# EAGLE design ardu_heli (EAGLE 5.10)
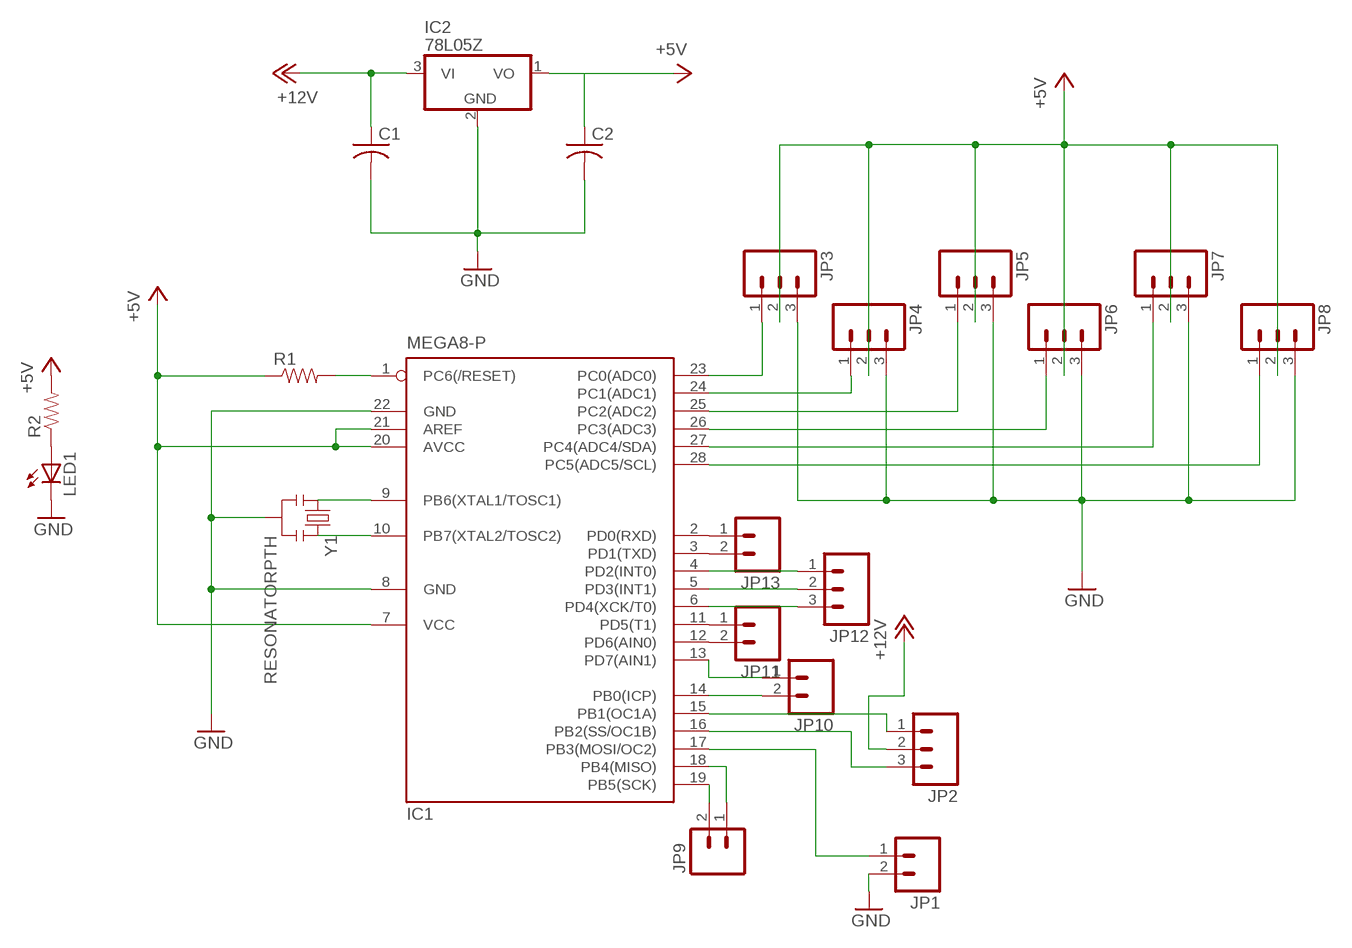
[diagram p0: schematic, sheet 1]

## Parts
C1  C-US025-030X050  [C025-030X050]
C2  C-US025-030X050  [C025-030X050]
IC1  MEGA8-P  [DIL28-3]
IC2  78L05Z  [TO92]
JP1  M02PTH  [1X02]
JP2  M03PTH  [1X03]
JP3  M03PTH  [1X03]
JP4  M03PTH  [1X03]
JP5  M03PTH  [1X03]
JP6  M03PTH  [1X03]
JP7  M03PTH  [1X03]
JP8  M03PTH  [1X03]
JP9  M02PTH  [1X02]
JP10  M02PTH  [1X02]
JP11  M02PTH  [1X02]
JP12  M03PTH  [1X03]
JP13  M02PTH  [1X02]
LED1  LED3MM  [LED3MM]
R1  RESISTORPTH-1/6W  [1/6W-RES]
R2  RESISTORPTH-1/6W  [1/6W-RES]
Y1  RESONATORPTH  [RESONATOR-PTH]

## Nets
+5V: C2.1 IC1.7(VCC) IC1.20(AVCC) IC1.21(AREF) IC2.1(VO) JP3.2 JP4.2 JP5.2 JP6.2 JP7.2 JP8.2 R1.1 R2.2
+12V: C1.1 IC2.3(VI) JP2.2
GND: C1.2 C2.2 IC1.8(GND) IC1.22(GND) IC2.2(GND) JP1.2 JP3.3 JP4.3 JP5.3 JP6.3 JP7.3 JP8.3 LED1.K(C) Y1.2
N$1: IC1.10(PB7(XTAL2/TOSC2)) Y1.3
N$2: IC1.9(PB6(XTAL1/TOSC1)) Y1.1
N$3: IC1.23(PC0(ADC0)) JP3.1
N$4: IC1.24(PC1(ADC1)) JP4.1
N$5: IC1.1(PC6(/RESET)) R1.2
N$6: IC1.15(PB1(OC1A)) JP2.1
N$7: IC1.16(PB2(SS/OC1B)) JP2.3
N$8: IC1.17(PB3(MOSI/OC2)) JP1.1
N$9: IC1.25(PC2(ADC2)) JP5.1
N$10: IC1.26(PC3(ADC3)) JP6.1
N$11: IC1.27(PC4(ADC4/SDA)) JP7.1
N$12: IC1.28(PC5(ADC5/SCL)) JP8.1
N$13: IC1.11(PD5(T1)) JP11.1
N$14: IC1.12(PD6(AIN0)) JP11.2
N$15: IC1.13(PD7(AIN1)) JP10.1
N$16: IC1.14(PB0(ICP)) JP10.2
N$17: IC1.19(PB5(SCK)) JP9.2
N$18: IC1.18(PB4(MISO)) JP9.1
N$19: IC1.2(PD0(RXD)) JP13.1
N$20: IC1.3(PD1(TXD)) JP13.2
N$21: IC1.6(PD4(XCK/T0)) JP12.3
N$22: IC1.5(PD3(INT1)) JP12.2
N$23: IC1.4(PD2(INT0)) JP12.1
N$24: LED1.A R2.1

## Library data of the parts
C1 C2 = rcl:C-US: CAPACITOR, American symbol
IC1 = atmel:MEGA8-P: MICROCONTROLLER 8 Kbytes FLASH, 1 kbytes SRAM, 512 bytes EEPROM, USART, 4-channel 10 bit ADC, 2-channel 8 bit ADC Pin compatible with Atmega48, ATMega88, ATMega168 Source: avr.lbr
IC2 = linear:78*: Positive VOLTAGE REGULATOR Source: http://cache.national.com/ds/LM/LM78L05.pdf http://www.fairchildsemi.com/ds/LM/LM7805.pdf
JP1 JP9-JP11 JP13 = SparkFun:M02: Header 2 Standard 2-pin 0.1" header. Use with straight break away headers (SKU : PRT-00116), right angle break away headers (PRT-00553), swiss pins (PRT-00743), machine pins (PRT-00117), and female headers (PRT-00115). Molex polarized connector foot print use with SKU : PRT-08233 with associated crimp pins and housings.
JP2-JP8 JP12 = SparkFun:M03: Header 3 Standard 3-pin 0.1" header. Use with straight break away headers (SKU : PRT-00116), right angle break away headers (PRT-00553), swiss pins (PRT-00743), machine pins (PRT-00117), and female headers (PRT-00115). Molex polarized connector foot print use with SKU : PRT-08232 with associated crimp pins and housings.
LED1 = SparkFun:LED: LEDs Standard schematic elements and footprints for 5mm, 3mm, 1206, and 0603 sized LEDs. 5mm - Spark Fun Electronics SKU : COM-00529 (and others)
R1 R2 = SparkFun:RESISTOR: Resistor Basic schematic elements and footprints for 0603, 1206, and PTH 1/10th watt (small) resistors.
Y1 = SparkFun:RESONATOR: Resonator Small SMD resonator. This is the itty bitty 10/20MHz resonators with built in caps. CSTCE10M0G55 and CSTCE20M0V53. Footprint has been reviewed closely but hasn't been tested yet.

## Board
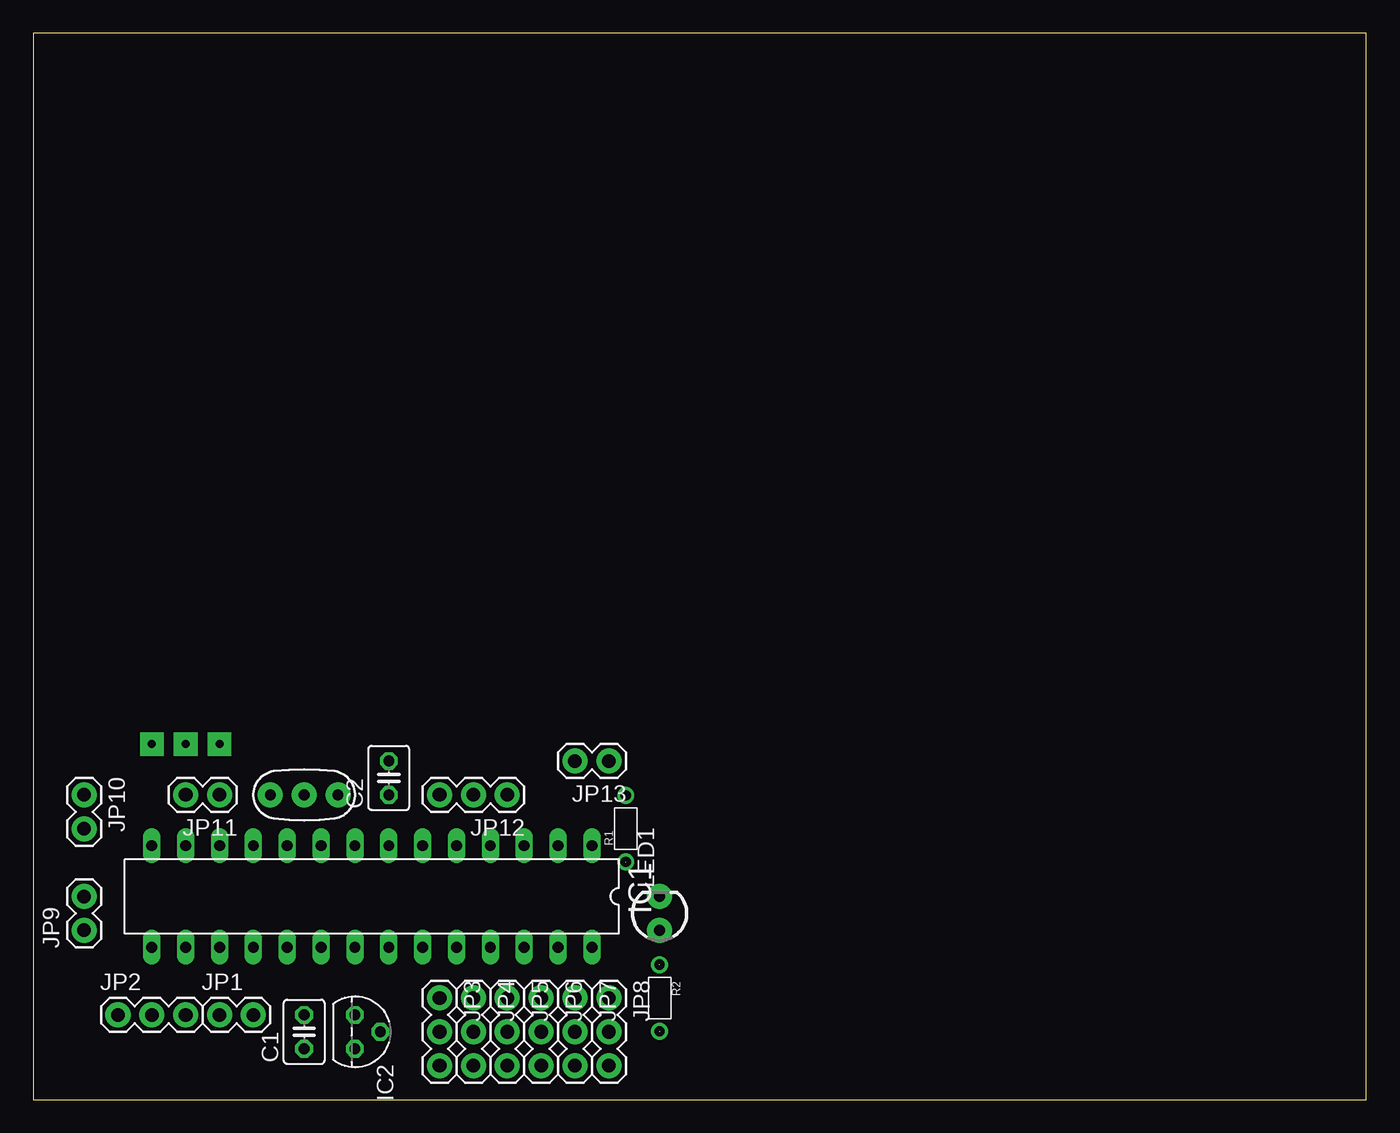
[diagram p1: board, top side]
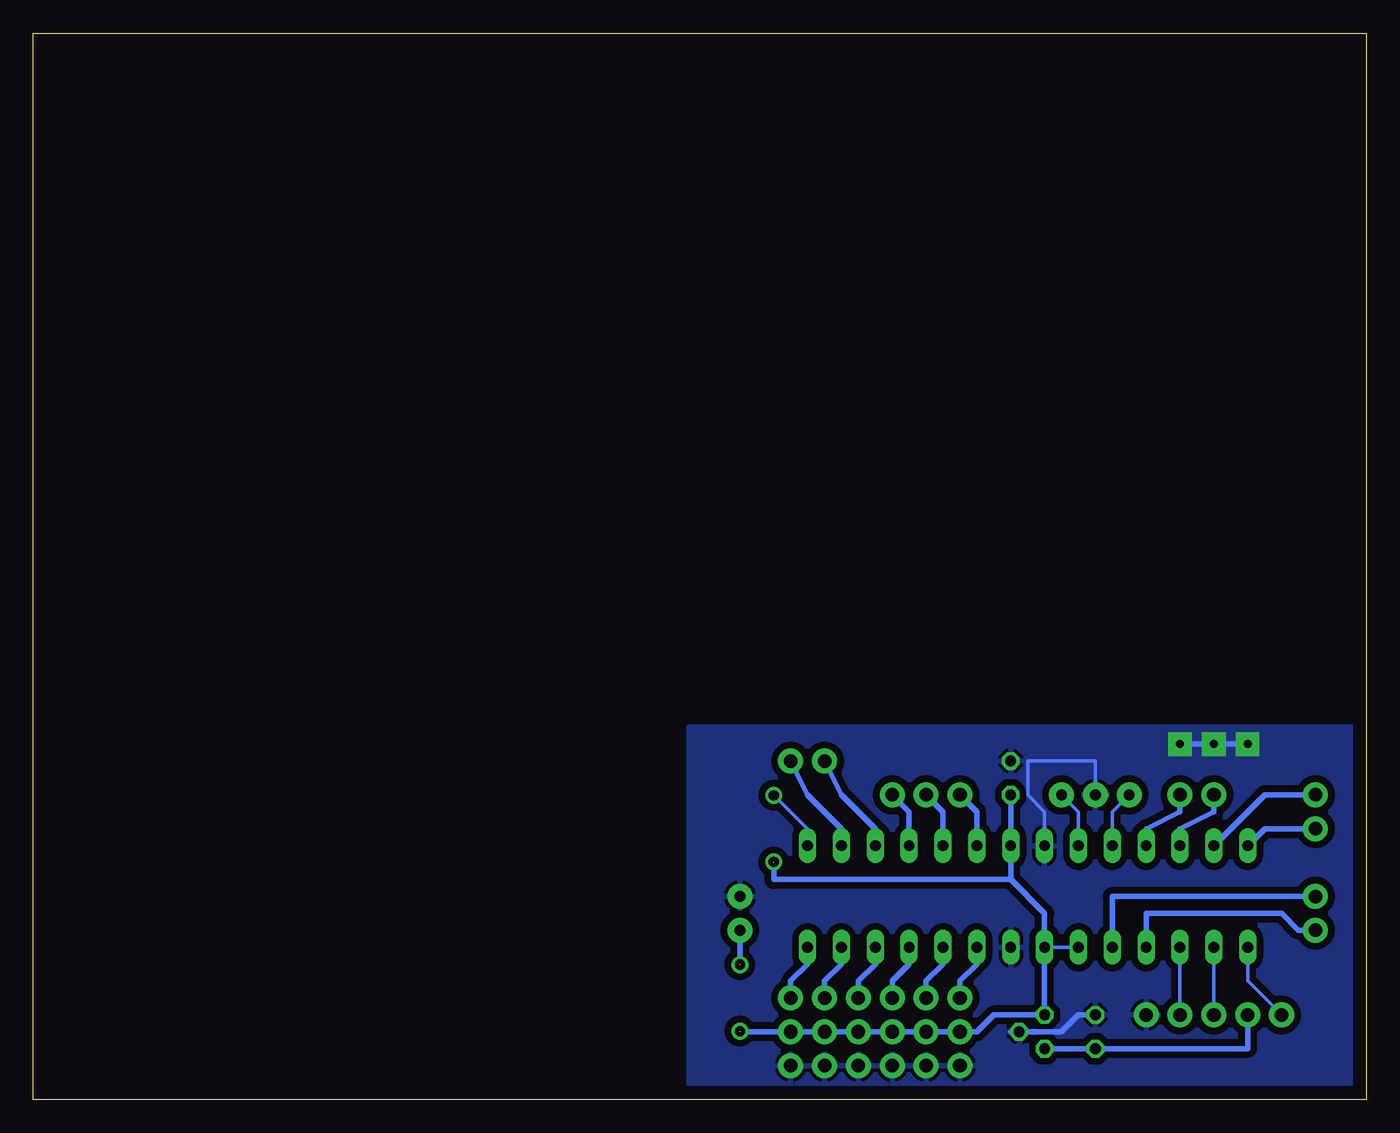
[diagram p2: board, bottom side, seen from below]

Size 100 x 80 mm. Coordinates in mm from the lower left corner, seen from the top.
Outline: 0,0 100,0 100,80 0,80 0,0
Copper layers (1*16): Top 0.035mm / dielectric 1.5mm / Bottom 0.035mm
Design rules "default *": minimum track width 10mil, minimum drill 24mil, track to track 20mil, track to pad 20mil, pad to pad 8mil, via to via 8mil, smd to smd 8mil, copper to edge 40mil, drill to drill 8mil, minimum pad ring 10mil, minimum via ring 8mil, stop-mask expansion 4mil, vias tented up to drill 0mil, thermal gap 10mil

### Footprints (pad centres in the part's own frame; a part is rotated, then mirrored left to right if it is on the bottom)
C025-030X050 = drill 0.813 octagon: 1 -1.27,0; 2 1.27,0
DIL28-3 = drill 0.813 long: 1 -16.51,-3.81; 2 -13.97,-3.81; 3 -11.43,-3.81; 4 -8.89,-3.81; 5 -6.35,-3.81; 6 -3.81,-3.81; 7 -1.27,-3.81; 8 1.27,-3.81; 9 3.81,-3.81; 10 6.35,-3.81; 11 8.89,-3.81; 12 11.43,-3.81; 13 13.97,-3.81; 14 16.51,-3.81; 15 16.51,3.81; 16 13.97,3.81; 17 11.43,3.81; 18 8.89,3.81; 19 6.35,3.81; 20 3.81,3.81; 21 1.27,3.81; 22 -1.27,3.81; 23 -3.81,3.81; 24 -6.35,3.81; 25 -8.89,3.81; 26 -11.43,3.81; 27 -13.97,3.81; 28 -16.51,3.81
TO92 = drill 0.813 octagon: 1 -1.27,0; 2 0,1.905; 3 1.27,0
1X02 = drill 1.016 pad 1.88 round: 1 0,0; 2 2.54,0
1X03 = drill 1.016 pad 1.88 round: 1 0,0; 2 2.54,0; 3 5.08,0
LED3MM = drill 0.813 pad 1.88 round: A -1.27,0; K 1.27,0
1/6W-RES = drill 0.762 round: 1 -2.5,0; 2 2.5,0
RESONATOR-PTH = drill 0.8 pad 1.88 round: 1 -2.54,0; 2 0,0; 3 2.54,0

### Placement (x,y rotation side)
C1  20.32,5.08 90 top
C2  26.67,24.13 90 top
IC1  25.4,15.24 180 top
IC2  24.13,5.08 270 top
JP1  13.97,6.35 0 top
JP2  6.35,6.35 0 top
JP3  30.48,7.62 270 top
JP4  33.02,7.62 270 top
JP5  35.56,7.62 270 top
JP6  38.1,7.62 270 top
JP7  40.64,7.62 270 top
JP8  43.18,7.62 270 top
JP9  3.81,12.7 90 top
JP10  3.81,22.86 270 top
JP11  13.97,22.86 180 top
JP12  35.56,22.86 180 top
JP13  43.18,25.4 180 top
LED1  46.99,13.97 90 top
R1  44.45,20.32 90 top
R2  46.99,7.62 270 top
Y1  20.32,22.86 180 top

### Tracks (layer width: path | path; a pad name or v marks a point on that pad's centre or on a via)
+5V  (2 unrouted)
  Bottom 0.254: IC1.21 IC1.20
  Bottom 0.406: 26.67,16.51 24.13,13.97 IC1.21 IC2.1 27.94,6.35 29.21,5.08 JP3.2 JP4.2 JP5.2 JP6.2 JP7.2 JP8.2 46.99,5.08 | 26.67,16.51 IC1.7 C2.1 | 26.67,16.51 44.45,16.51 44.45,17.78
+12V
  Bottom 0.406: IC2.3 C1.1 8.89,3.81 JP2.2
GND  (via drill 0.6 pad 1.78)
  Bottom 0.254: IC1.8 24.13,21.59 25.4,22.86 25.4,25.4 20.32,25.4 Y1.2
  Bottom 0.406: IC2.2 26.67,5.08 | v8.89,26.67 v11.43,26.67 v13.97,26.67 | 25.4,5.08 22.86,5.08 21.59,6.35 C1.2
  pour Bottom: 0,27.94 0,0 50.8,0 50.8,27.94
N$1
  Bottom 0.254: IC1.10 19.05,21.59 Y1.3
N$2
  Bottom 0.254: IC1.9 21.59,21.59 Y1.1
N$3
  Bottom 0.406: JP3.1 30.48,8.89 29.21,10.16 IC1.23
N$4
  Bottom 0.406: JP4.1 33.02,8.89 31.75,10.16 IC1.24
N$5
  Bottom 0.254: R1.2 41.91,20.32 IC1.1
N$6
  Bottom 0.254: JP2.1 8.89,8.89 IC1.15
N$7
  Bottom 0.254: JP2.3 IC1.16
N$8
  Bottom 0.254: JP1.1 IC1.17
N$9
  Bottom 0.406: JP5.1 35.56,8.89 34.29,10.16 IC1.25
N$10
  Bottom 0.406: JP6.1 38.1,8.89 36.83,10.16 IC1.26
N$11
  Bottom 0.406: JP7.1 40.64,8.89 39.37,10.16 IC1.27
N$12
  Bottom 0.406: JP8.1 43.18,8.89 41.91,10.16 IC1.28
N$13
  Bottom 0.406: JP11.1 13.97,21.59 16.51,20.32 IC1.11
N$14
  Bottom 0.406: IC1.12 13.97,20.32 11.43,21.59 JP11.2
N$15
  Bottom 0.406: JP10.1 7.62,22.86 IC1.13
N$16
  Bottom 0.406: JP10.2 7.62,20.32 IC1.14
N$17
  Bottom 0.406: JP9.2 19.05,15.24 IC1.19
N$18
  Bottom 0.406: IC1.18 16.51,13.97 6.35,13.97 5.08,12.7 JP9.1
N$19
  Bottom 0.406: IC1.2 39.37,20.32 41.91,22.86 JP13.1
N$20
  Bottom 0.406: IC1.3 36.83,20.32 39.37,22.86 JP13.2
N$21
  Bottom 0.406: IC1.6 29.21,21.59 JP12.3
N$22
  Bottom 0.406: IC1.5 31.75,21.59 JP12.2
N$23
  Bottom 0.406: IC1.4 34.29,21.59 JP12.1
N$24  (1 unrouted)
  Bottom 0.406: 46.99,10.16 LED1.A